# Altium schematic sheet CHIP.SchDoc: ICGTRRP2_CHIP
size A1; Author: M. Reza Pazhouhandeh; SheetNumber: 1; SheetTotal: 3; Time: Summer 2017
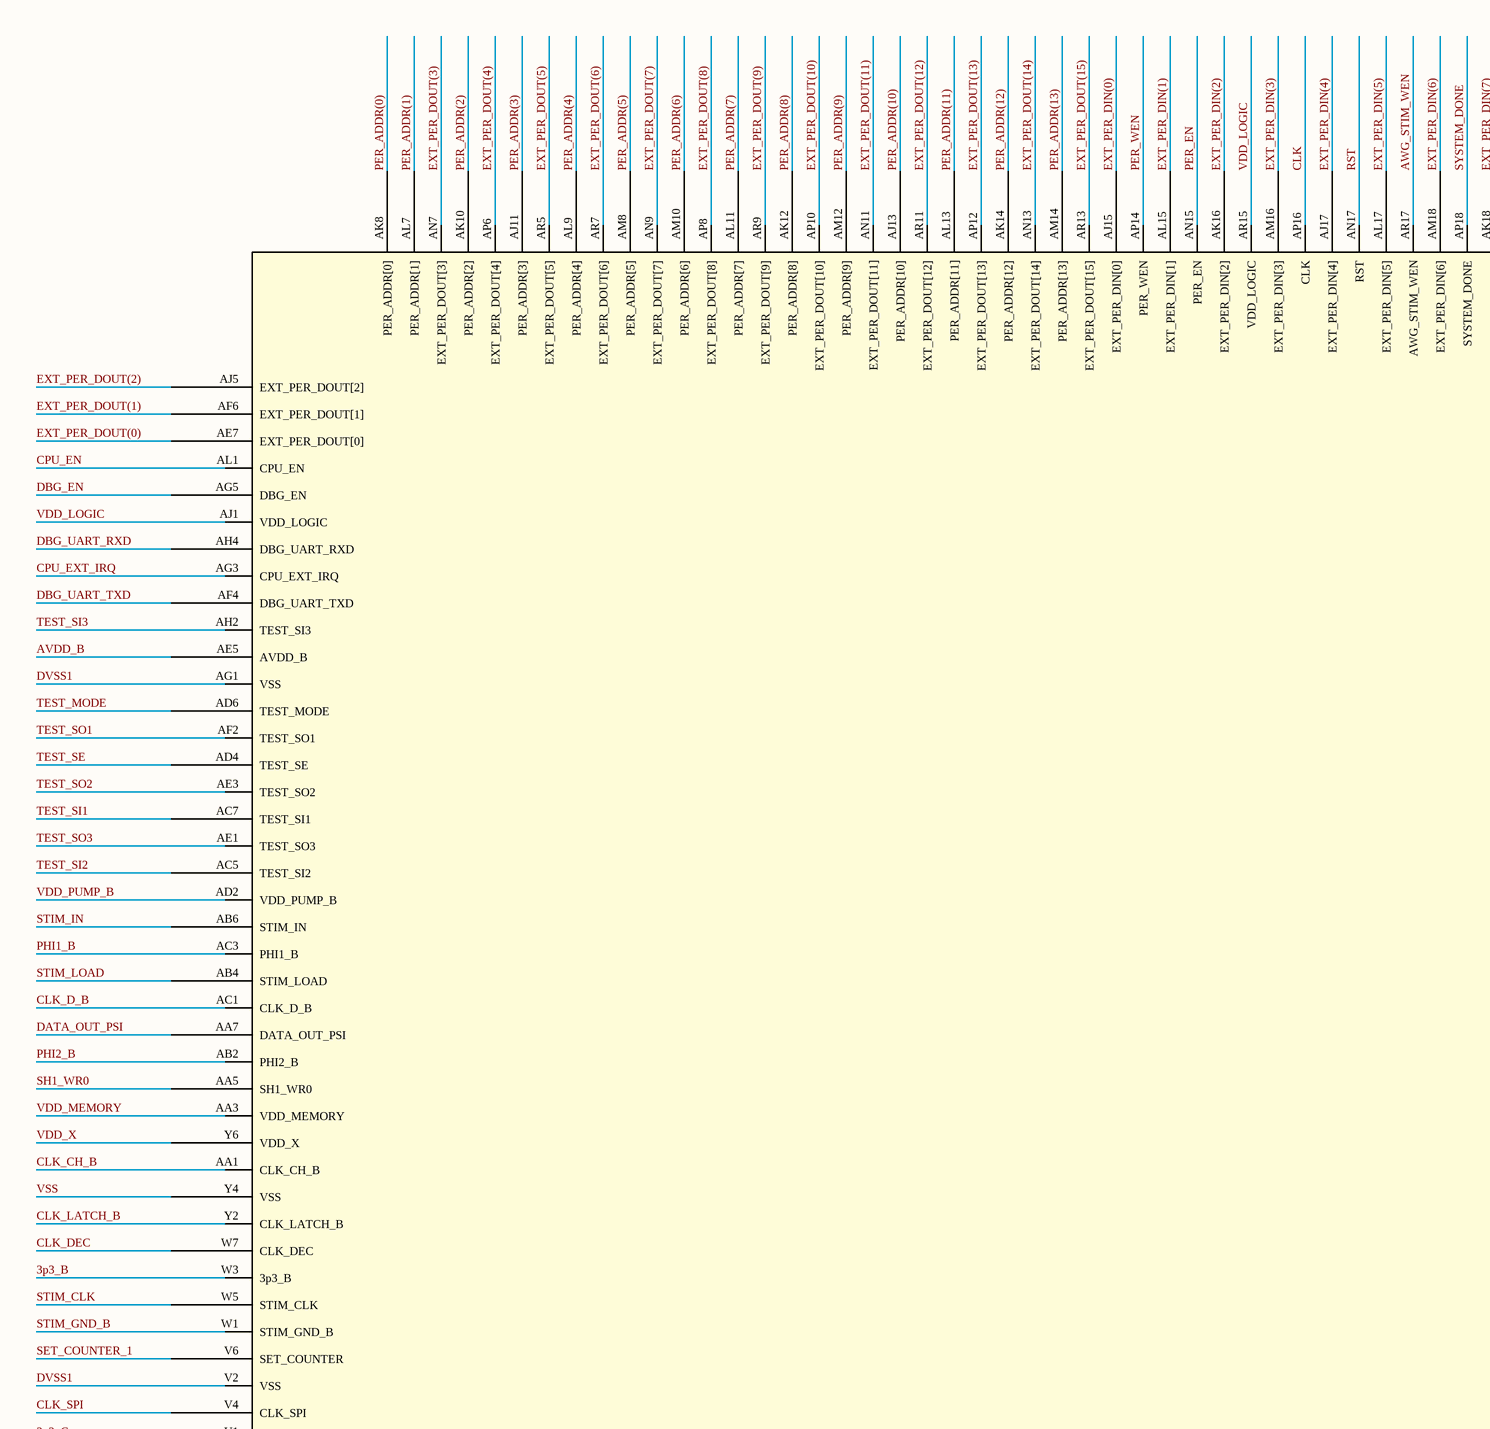
[diagram p0: CHIP.SchDoc, top left]
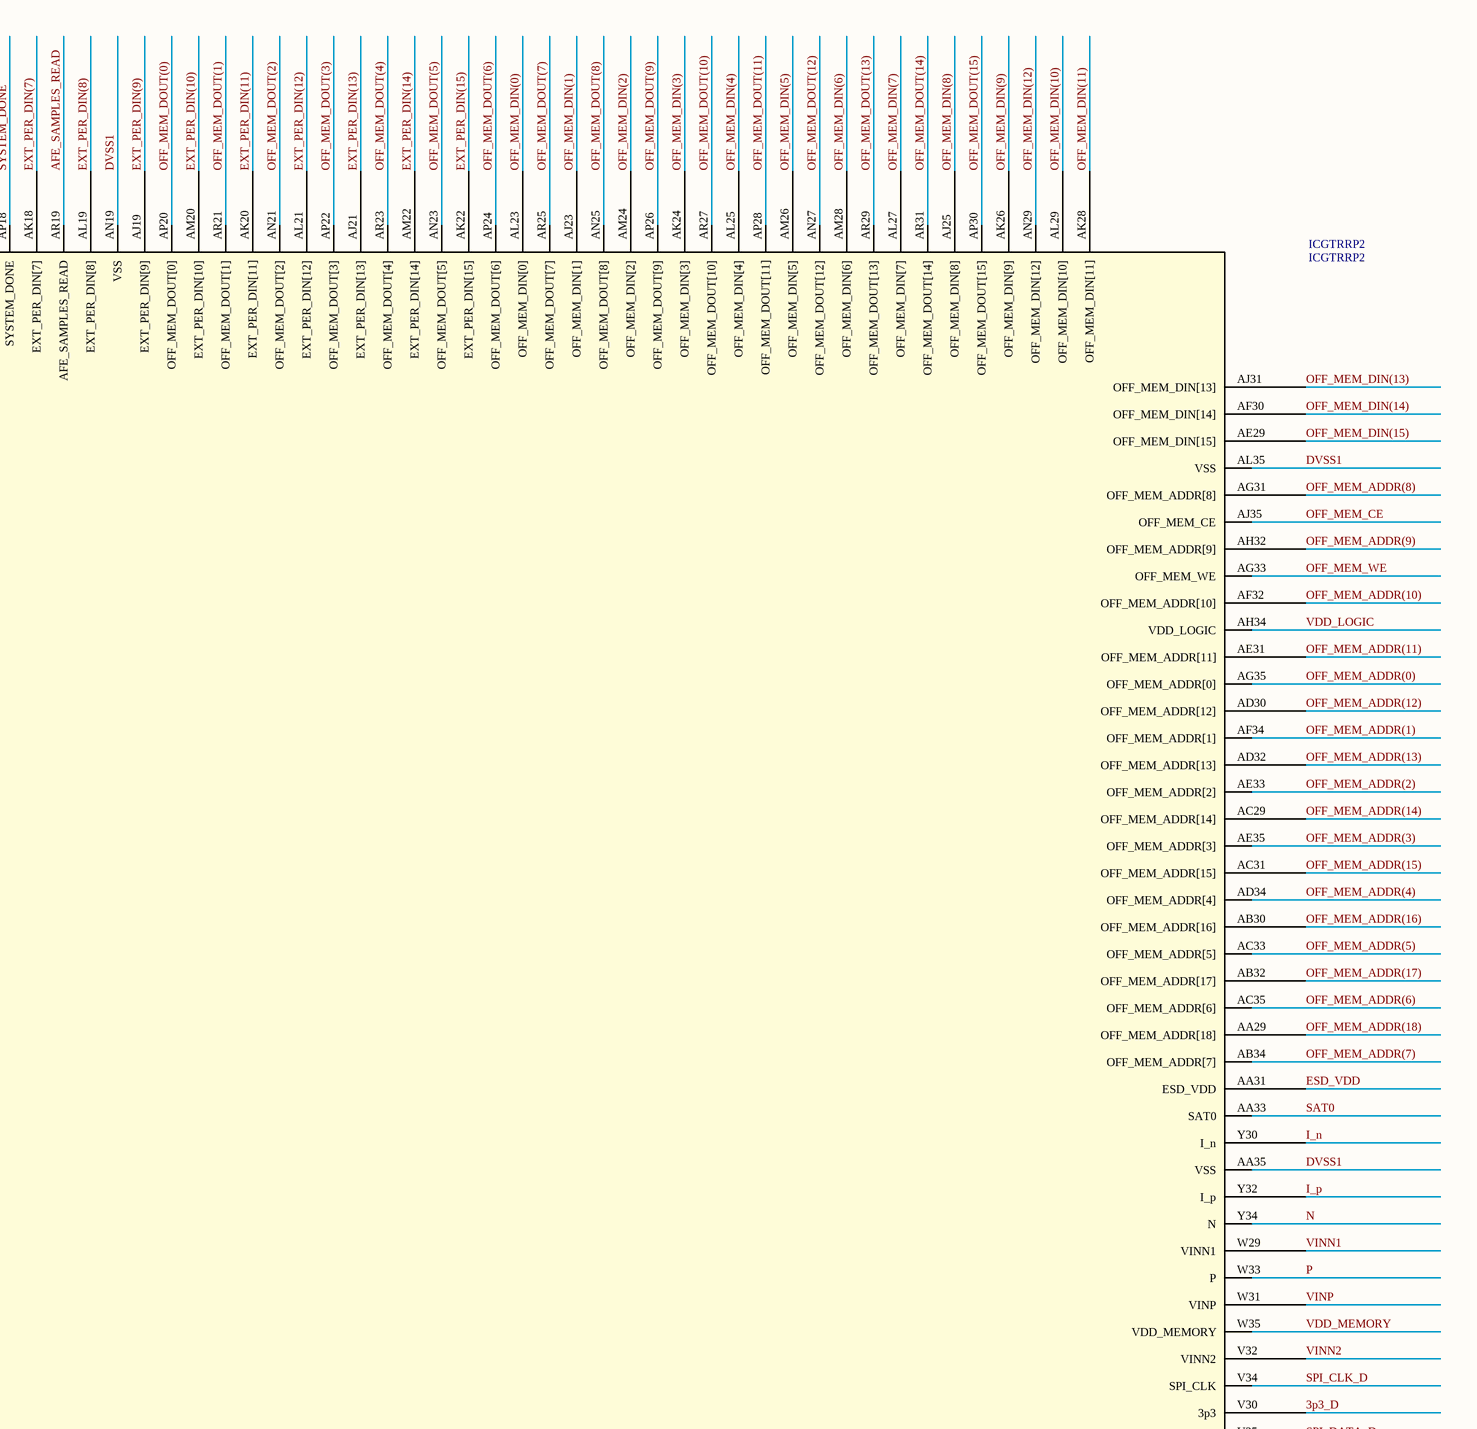
[diagram p1: CHIP.SchDoc, top right]
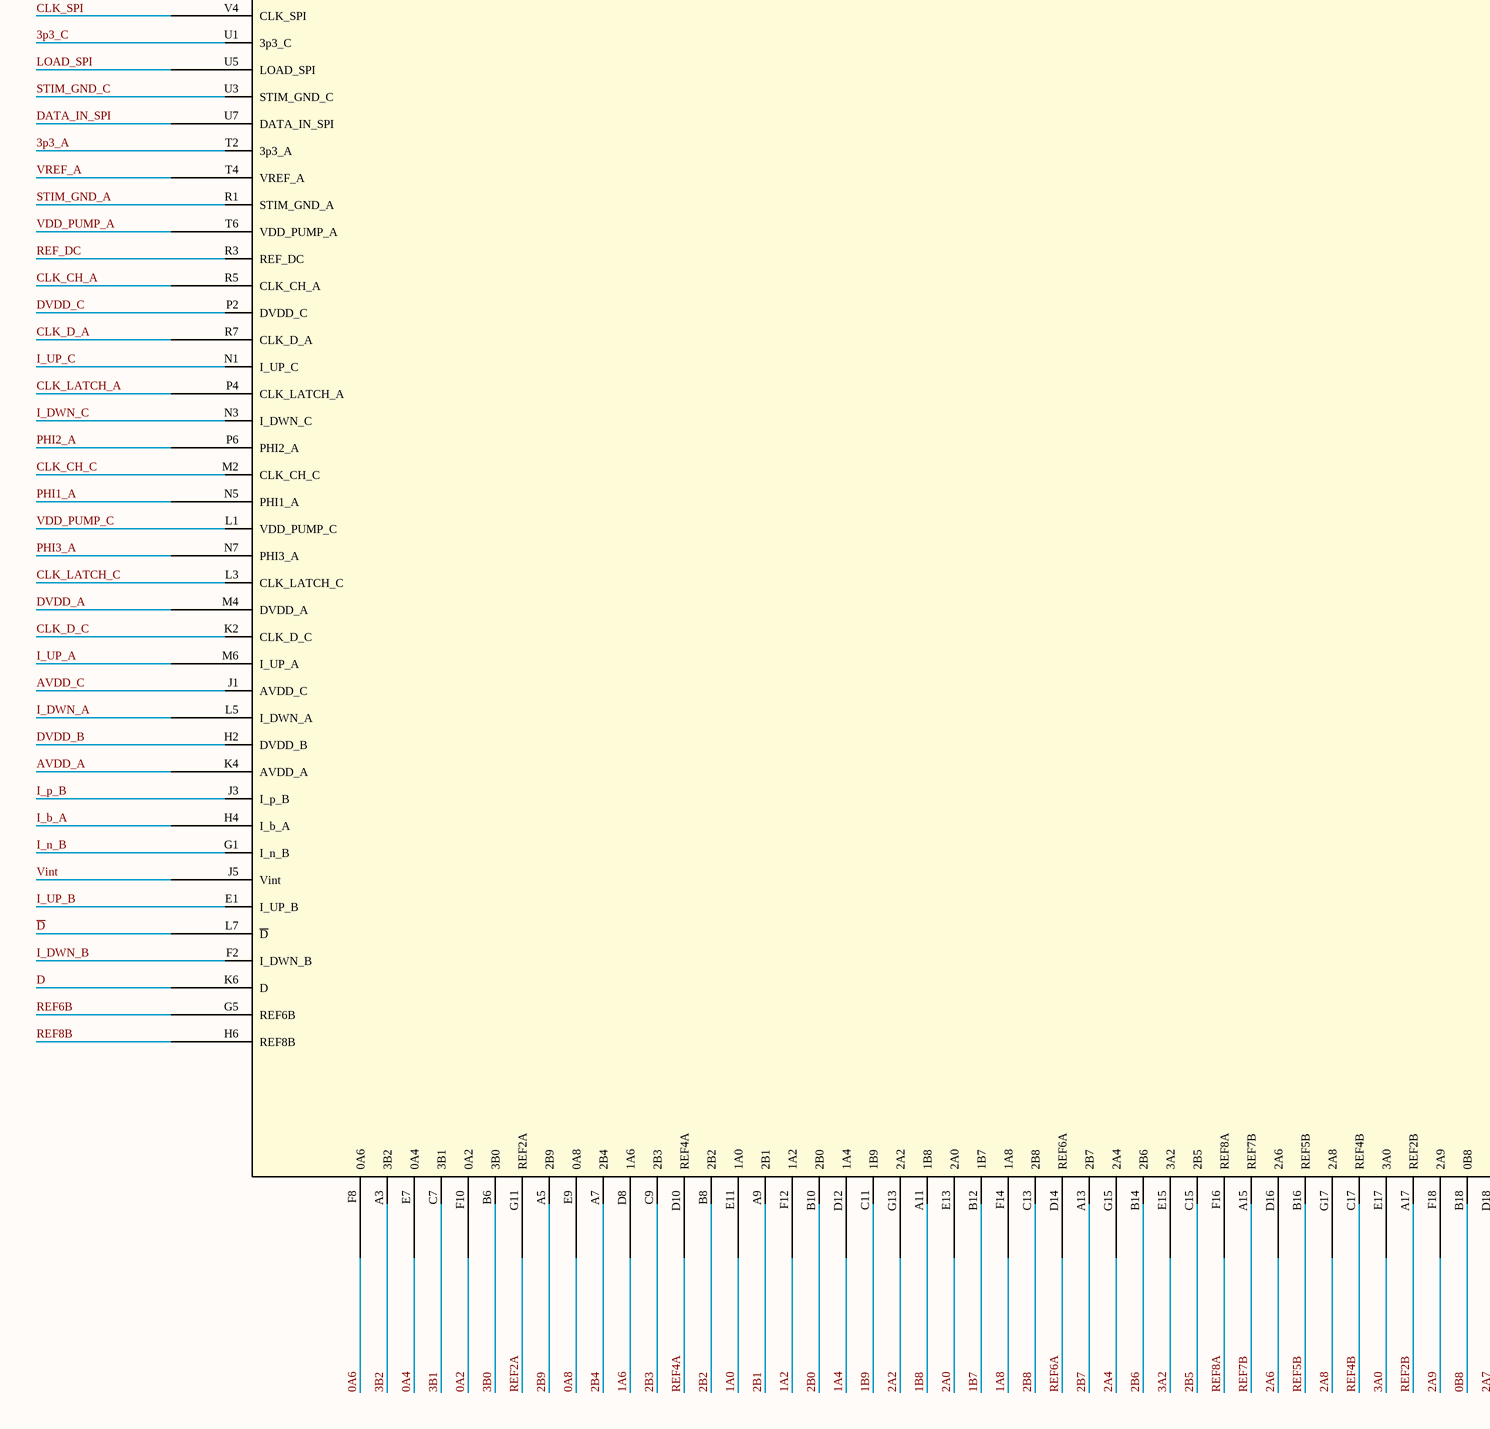
[diagram p2: CHIP.SchDoc, bottom left]
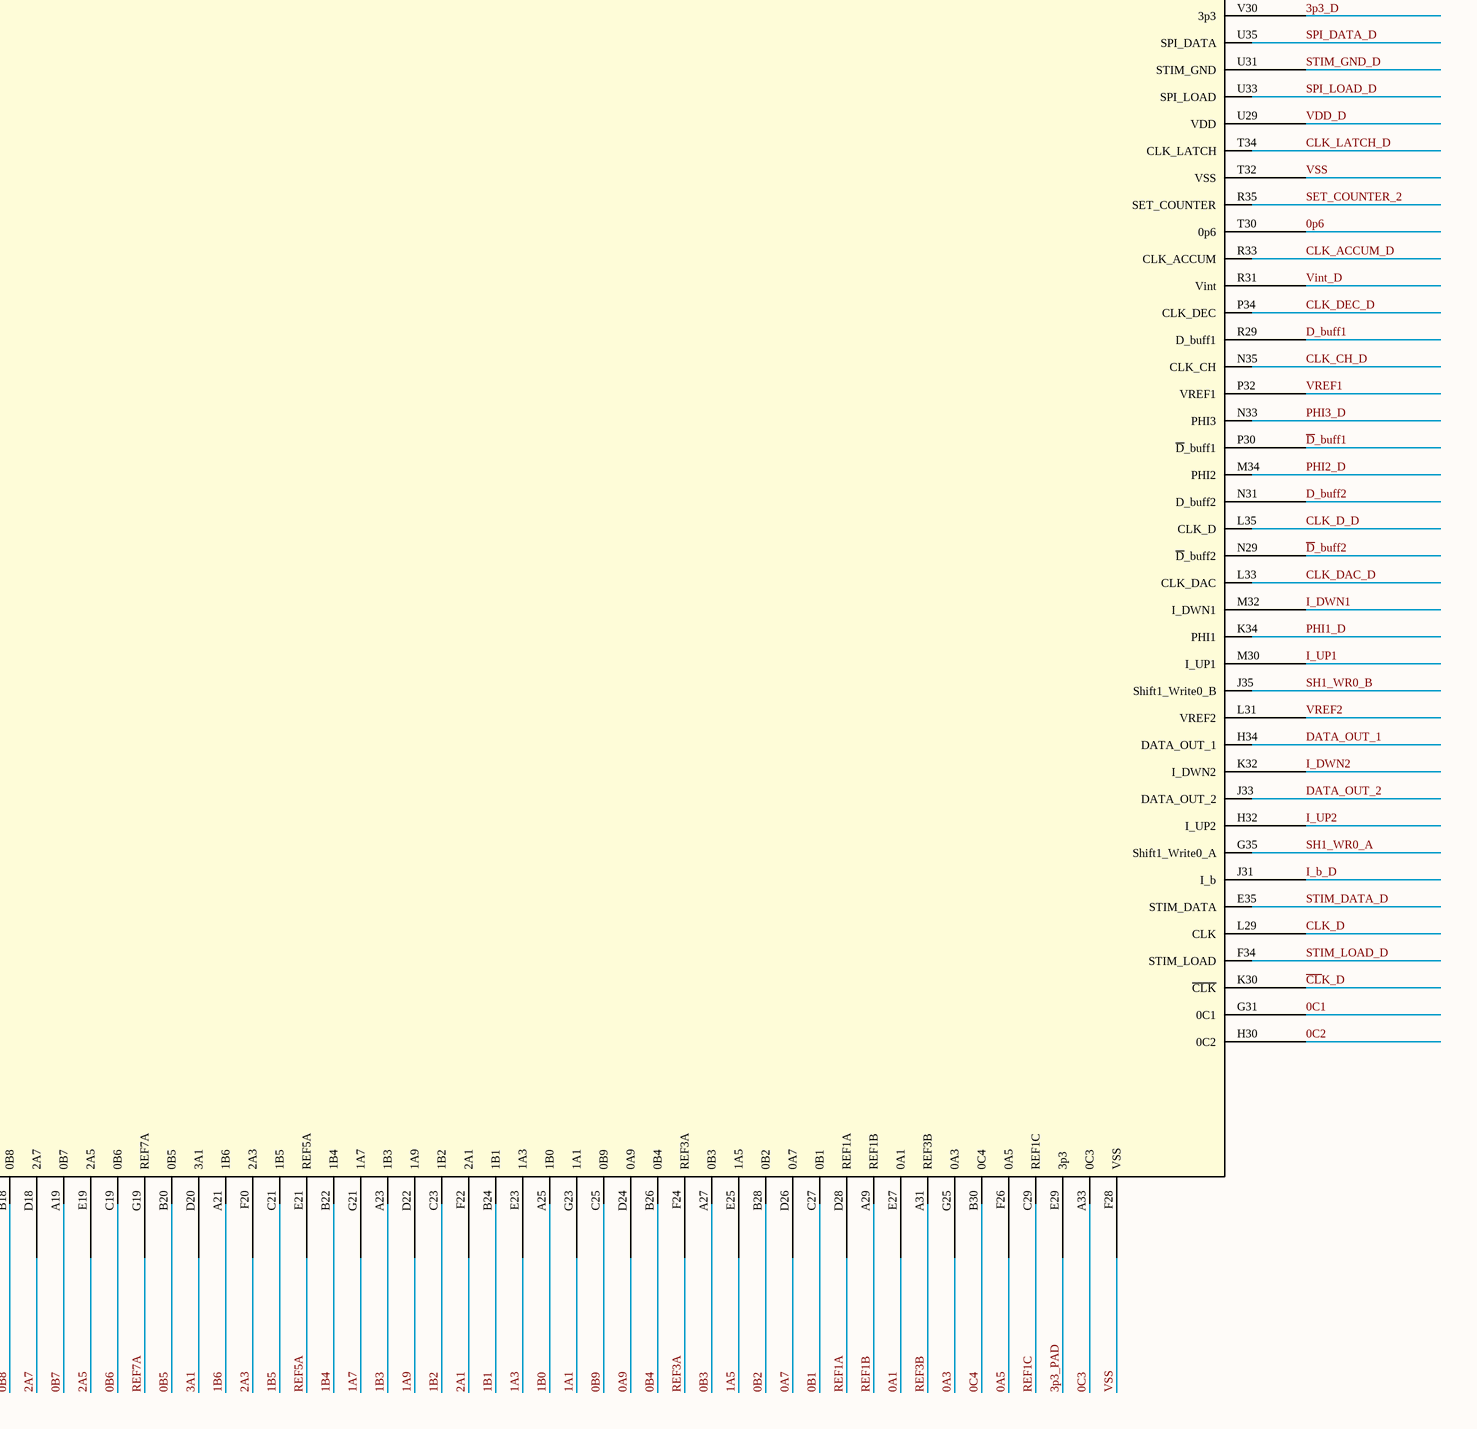
[diagram p3: CHIP.SchDoc, bottom right]

## Parts
ICGTRRP2  ICGTRRP2  [PGA391]

## Nets
0A1: ICGTRRP2.E27(0A1)
0A2: ICGTRRP2.F10(0A2)
0A3: ICGTRRP2.G25(0A3)
0A4: ICGTRRP2.E7(0A4)
0A5: ICGTRRP2.F26(0A5)
0A6: ICGTRRP2.F8(0A6)
0A7: ICGTRRP2.D26(0A7)
0A8: ICGTRRP2.E9(0A8)
0A9: ICGTRRP2.D24(0A9)
0B1: ICGTRRP2.C27(0B1)
0B2: ICGTRRP2.B28(0B2)
0B3: ICGTRRP2.A27(0B3)
0B4: ICGTRRP2.B26(0B4)
0B5: ICGTRRP2.B20(0B5)
0B6: ICGTRRP2.C19(0B6)
0B7: ICGTRRP2.A19(0B7)
0B8: ICGTRRP2.B18(0B8)
0B9: ICGTRRP2.C25(0B9)
0C1: ICGTRRP2.G31(0C1)
0C2: ICGTRRP2.H30(0C2)
0C3: ICGTRRP2.A33(0C3)
0C4: ICGTRRP2.B30(0C4)
0p6: ICGTRRP2.T30(0p6)
1A0: ICGTRRP2.E11(1A0)
1A1: ICGTRRP2.G23(1A1)
1A2: ICGTRRP2.F12(1A2)
1A3: ICGTRRP2.E23(1A3)
1A4: ICGTRRP2.D12(1A4)
1A5: ICGTRRP2.E25(1A5)
1A6: ICGTRRP2.D8(1A6)
1A7: ICGTRRP2.G21(1A7)
1A8: ICGTRRP2.F14(1A8)
1A9: ICGTRRP2.D22(1A9)
1B0: ICGTRRP2.A25(1B0)
1B1: ICGTRRP2.B24(1B1)
1B2: ICGTRRP2.C23(1B2)
1B3: ICGTRRP2.A23(1B3)
1B4: ICGTRRP2.B22(1B4)
1B5: ICGTRRP2.C21(1B5)
1B6: ICGTRRP2.A21(1B6)
1B7: ICGTRRP2.B12(1B7)
1B8: ICGTRRP2.A11(1B8)
1B9: ICGTRRP2.C11(1B9)
2A0: ICGTRRP2.E13(2A0)
2A1: ICGTRRP2.F22(2A1)
2A2: ICGTRRP2.G13(2A2)
2A3: ICGTRRP2.F20(2A3)
2A4: ICGTRRP2.G15(2A4)
2A5: ICGTRRP2.E19(2A5)
2A6: ICGTRRP2.D16(2A6)
2A7: ICGTRRP2.D18(2A7)
2A8: ICGTRRP2.G17(2A8)
2A9: ICGTRRP2.F18(2A9)
2B0: ICGTRRP2.B10(2B0)
2B1: ICGTRRP2.A9(2B1)
2B2: ICGTRRP2.B8(2B2)
2B3: ICGTRRP2.C9(2B3)
2B4: ICGTRRP2.A7(2B4)
2B5: ICGTRRP2.C15(2B5)
2B6: ICGTRRP2.B14(2B6)
2B7: ICGTRRP2.A13(2B7)
2B8: ICGTRRP2.C13(2B8)
2B9: ICGTRRP2.A5(2B9)
3A0: ICGTRRP2.E17(3A0)
3A1: ICGTRRP2.D20(3A1)
3A2: ICGTRRP2.E15(3A2)
3B0: ICGTRRP2.B6(3B0)
3B1: ICGTRRP2.C7(3B1)
3B2: ICGTRRP2.A3(3B2)
3p3_A: ICGTRRP2.T2(3p3_A)
3p3_B: ICGTRRP2.W3(3p3_B)
3p3_C: ICGTRRP2.U1(3p3_C)
3p3_D: ICGTRRP2.V30(3p3)
3p3_PAD: ICGTRRP2.E29(3p3)
AFE_SAMPLES_READ: ICGTRRP2.AR19(AFE_SAMPLES_READ)
AVDD_A: ICGTRRP2.K4(AVDD_A)
AVDD_B: ICGTRRP2.AE5(AVDD_B)
AVDD_C: ICGTRRP2.J1(AVDD_C)
AWG_STIM_WEN: ICGTRRP2.AR17(AWG_STIM_WEN)
~{CL}K_D: ICGTRRP2.K30(~{CLK})
CLK: ICGTRRP2.AP16(CLK)
CLK_ACCUM_D: ICGTRRP2.R33(CLK_ACCUM)
CLK_CH_A: ICGTRRP2.R5(CLK_CH_A)
CLK_CH_B: ICGTRRP2.AA1(CLK_CH_B)
CLK_CH_C: ICGTRRP2.M2(CLK_CH_C)
CLK_CH_D: ICGTRRP2.N35(CLK_CH)
CLK_D: ICGTRRP2.L29(CLK)
CLK_D_A: ICGTRRP2.R7(CLK_D_A)
CLK_D_B: ICGTRRP2.AC1(CLK_D_B)
CLK_D_C: ICGTRRP2.K2(CLK_D_C)
CLK_D_D: ICGTRRP2.L35(CLK_D)
CLK_DAC_D: ICGTRRP2.L33(CLK_DAC)
CLK_DEC: ICGTRRP2.W7(CLK_DEC)
CLK_DEC_D: ICGTRRP2.P34(CLK_DEC)
CLK_LATCH_A: ICGTRRP2.P4(CLK_LATCH_A)
CLK_LATCH_B: ICGTRRP2.Y2(CLK_LATCH_B)
CLK_LATCH_C: ICGTRRP2.L3(CLK_LATCH_C)
CLK_LATCH_D: ICGTRRP2.T34(CLK_LATCH)
CLK_SPI: ICGTRRP2.V4(CLK_SPI)
CPU_EN: ICGTRRP2.AL1(CPU_EN)
CPU_EXT_IRQ: ICGTRRP2.AG3(CPU_EXT_IRQ)
D: ICGTRRP2.K6(D)
~{D}: ICGTRRP2.L7(~{D})
~{D}_buff1: ICGTRRP2.P30(~{D}_buff1)
~{D}_buff2: ICGTRRP2.N29(~{D}_buff2)
D_buff1: ICGTRRP2.R29(D_buff1)
D_buff2: ICGTRRP2.N31(D_buff2)
DATA_IN_SPI: ICGTRRP2.U7(DATA_IN_SPI)
DATA_OUT_1: ICGTRRP2.H34(DATA_OUT_1)
DATA_OUT_2: ICGTRRP2.J33(DATA_OUT_2)
DATA_OUT_PSI: ICGTRRP2.AA7(DATA_OUT_PSI)
DBG_EN: ICGTRRP2.AG5(DBG_EN)
DBG_UART_RXD: ICGTRRP2.AH4(DBG_UART_RXD)
DBG_UART_TXD: ICGTRRP2.AF4(DBG_UART_TXD)
DVDD_A: ICGTRRP2.M4(DVDD_A)
DVDD_B: ICGTRRP2.H2(DVDD_B)
DVDD_C: ICGTRRP2.P2(DVDD_C)
DVSS1: ICGTRRP2.AA35(VSS) ICGTRRP2.AG1(VSS) ICGTRRP2.AL35(VSS) ICGTRRP2.AN19(VSS) ICGTRRP2.V2(VSS)
ESD_VDD: ICGTRRP2.AA31(ESD_VDD)
EXT_PER_DIN(0): ICGTRRP2.AJ15(EXT_PER_DIN[0])
EXT_PER_DIN(1): ICGTRRP2.AL15(EXT_PER_DIN[1])
EXT_PER_DIN(2): ICGTRRP2.AK16(EXT_PER_DIN[2])
EXT_PER_DIN(3): ICGTRRP2.AM16(EXT_PER_DIN[3])
EXT_PER_DIN(4): ICGTRRP2.AJ17(EXT_PER_DIN[4])
EXT_PER_DIN(5): ICGTRRP2.AL17(EXT_PER_DIN[5])
EXT_PER_DIN(6): ICGTRRP2.AM18(EXT_PER_DIN[6])
EXT_PER_DIN(7): ICGTRRP2.AK18(EXT_PER_DIN[7])
EXT_PER_DIN(8): ICGTRRP2.AL19(EXT_PER_DIN[8])
EXT_PER_DIN(9): ICGTRRP2.AJ19(EXT_PER_DIN[9])
EXT_PER_DIN(10): ICGTRRP2.AM20(EXT_PER_DIN[10])
EXT_PER_DIN(11): ICGTRRP2.AK20(EXT_PER_DIN[11])
EXT_PER_DIN(12): ICGTRRP2.AL21(EXT_PER_DIN[12])
EXT_PER_DIN(13): ICGTRRP2.AJ21(EXT_PER_DIN[13])
EXT_PER_DIN(14): ICGTRRP2.AM22(EXT_PER_DIN[14])
EXT_PER_DIN(15): ICGTRRP2.AK22(EXT_PER_DIN[15])
EXT_PER_DOUT(0): ICGTRRP2.AE7(EXT_PER_DOUT[0])
EXT_PER_DOUT(1): ICGTRRP2.AF6(EXT_PER_DOUT[1])
EXT_PER_DOUT(2): ICGTRRP2.AJ5(EXT_PER_DOUT[2])
EXT_PER_DOUT(3): ICGTRRP2.AN7(EXT_PER_DOUT[3])
EXT_PER_DOUT(4): ICGTRRP2.AP6(EXT_PER_DOUT[4])
EXT_PER_DOUT(5): ICGTRRP2.AR5(EXT_PER_DOUT[5])
EXT_PER_DOUT(6): ICGTRRP2.AR7(EXT_PER_DOUT[6])
EXT_PER_DOUT(7): ICGTRRP2.AN9(EXT_PER_DOUT[7])
EXT_PER_DOUT(8): ICGTRRP2.AP8(EXT_PER_DOUT[8])
EXT_PER_DOUT(9): ICGTRRP2.AR9(EXT_PER_DOUT[9])
EXT_PER_DOUT(10): ICGTRRP2.AP10(EXT_PER_DOUT[10])
EXT_PER_DOUT(11): ICGTRRP2.AN11(EXT_PER_DOUT[11])
EXT_PER_DOUT(12): ICGTRRP2.AR11(EXT_PER_DOUT[12])
EXT_PER_DOUT(13): ICGTRRP2.AP12(EXT_PER_DOUT[13])
EXT_PER_DOUT(14): ICGTRRP2.AN13(EXT_PER_DOUT[14])
EXT_PER_DOUT(15): ICGTRRP2.AR13(EXT_PER_DOUT[15])
I_b_A: ICGTRRP2.H4(I_b_A)
I_b_D: ICGTRRP2.J31(I_b)
I_DWN1: ICGTRRP2.M32(I_DWN1)
I_DWN2: ICGTRRP2.K32(I_DWN2)
I_DWN_A: ICGTRRP2.L5(I_DWN_A)
I_DWN_B: ICGTRRP2.F2(I_DWN_B)
I_DWN_C: ICGTRRP2.N3(I_DWN_C)
I_n: ICGTRRP2.Y30(I_n)
I_n_B: ICGTRRP2.G1(I_n_B)
I_p: ICGTRRP2.Y32(I_p)
I_p_B: ICGTRRP2.J3(I_p_B)
I_UP1: ICGTRRP2.M30(I_UP1)
I_UP2: ICGTRRP2.H32(I_UP2)
I_UP_A: ICGTRRP2.M6(I_UP_A)
I_UP_B: ICGTRRP2.E1(I_UP_B)
I_UP_C: ICGTRRP2.N1(I_UP_C)
LOAD_SPI: ICGTRRP2.U5(LOAD_SPI)
N: ICGTRRP2.Y34(N)
OFF_MEM_ADDR(0): ICGTRRP2.AG35(OFF_MEM_ADDR[0])
OFF_MEM_ADDR(1): ICGTRRP2.AF34(OFF_MEM_ADDR[1])
OFF_MEM_ADDR(2): ICGTRRP2.AE33(OFF_MEM_ADDR[2])
OFF_MEM_ADDR(3): ICGTRRP2.AE35(OFF_MEM_ADDR[3])
OFF_MEM_ADDR(4): ICGTRRP2.AD34(OFF_MEM_ADDR[4])
OFF_MEM_ADDR(5): ICGTRRP2.AC33(OFF_MEM_ADDR[5])
OFF_MEM_ADDR(6): ICGTRRP2.AC35(OFF_MEM_ADDR[6])
OFF_MEM_ADDR(7): ICGTRRP2.AB34(OFF_MEM_ADDR[7])
OFF_MEM_ADDR(8): ICGTRRP2.AG31(OFF_MEM_ADDR[8])
OFF_MEM_ADDR(9): ICGTRRP2.AH32(OFF_MEM_ADDR[9])
OFF_MEM_ADDR(10): ICGTRRP2.AF32(OFF_MEM_ADDR[10])
OFF_MEM_ADDR(11): ICGTRRP2.AE31(OFF_MEM_ADDR[11])
OFF_MEM_ADDR(12): ICGTRRP2.AD30(OFF_MEM_ADDR[12])
OFF_MEM_ADDR(13): ICGTRRP2.AD32(OFF_MEM_ADDR[13])
OFF_MEM_ADDR(14): ICGTRRP2.AC29(OFF_MEM_ADDR[14])
OFF_MEM_ADDR(15): ICGTRRP2.AC31(OFF_MEM_ADDR[15])
OFF_MEM_ADDR(16): ICGTRRP2.AB30(OFF_MEM_ADDR[16])
OFF_MEM_ADDR(17): ICGTRRP2.AB32(OFF_MEM_ADDR[17])
OFF_MEM_ADDR(18): ICGTRRP2.AA29(OFF_MEM_ADDR[18])
OFF_MEM_CE: ICGTRRP2.AJ35(OFF_MEM_CE)
OFF_MEM_DIN(0): ICGTRRP2.AL23(OFF_MEM_DIN[0])
OFF_MEM_DIN(1): ICGTRRP2.AJ23(OFF_MEM_DIN[1])
OFF_MEM_DIN(2): ICGTRRP2.AM24(OFF_MEM_DIN[2])
OFF_MEM_DIN(3): ICGTRRP2.AK24(OFF_MEM_DIN[3])
OFF_MEM_DIN(4): ICGTRRP2.AL25(OFF_MEM_DIN[4])
OFF_MEM_DIN(5): ICGTRRP2.AM26(OFF_MEM_DIN[5])
OFF_MEM_DIN(6): ICGTRRP2.AM28(OFF_MEM_DIN[6])
OFF_MEM_DIN(7): ICGTRRP2.AL27(OFF_MEM_DIN[7])
OFF_MEM_DIN(8): ICGTRRP2.AJ25(OFF_MEM_DIN[8])
OFF_MEM_DIN(9): ICGTRRP2.AK26(OFF_MEM_DIN[9])
OFF_MEM_DIN(10): ICGTRRP2.AL29(OFF_MEM_DIN[10])
OFF_MEM_DIN(11): ICGTRRP2.AK28(OFF_MEM_DIN[11])
OFF_MEM_DIN(12): ICGTRRP2.AN29(OFF_MEM_DIN[12])
OFF_MEM_DIN(13): ICGTRRP2.AJ31(OFF_MEM_DIN[13])
OFF_MEM_DIN(14): ICGTRRP2.AF30(OFF_MEM_DIN[14])
OFF_MEM_DIN(15): ICGTRRP2.AE29(OFF_MEM_DIN[15])
OFF_MEM_DOUT(0): ICGTRRP2.AP20(OFF_MEM_DOUT[0])
OFF_MEM_DOUT(1): ICGTRRP2.AR21(OFF_MEM_DOUT[1])
OFF_MEM_DOUT(2): ICGTRRP2.AN21(OFF_MEM_DOUT[2])
OFF_MEM_DOUT(3): ICGTRRP2.AP22(OFF_MEM_DOUT[3])
OFF_MEM_DOUT(4): ICGTRRP2.AR23(OFF_MEM_DOUT[4])
OFF_MEM_DOUT(5): ICGTRRP2.AN23(OFF_MEM_DOUT[5])
OFF_MEM_DOUT(6): ICGTRRP2.AP24(OFF_MEM_DOUT[6])
OFF_MEM_DOUT(7): ICGTRRP2.AR25(OFF_MEM_DOUT[7])
OFF_MEM_DOUT(8): ICGTRRP2.AN25(OFF_MEM_DOUT[8])
OFF_MEM_DOUT(9): ICGTRRP2.AP26(OFF_MEM_DOUT[9])
OFF_MEM_DOUT(10): ICGTRRP2.AR27(OFF_MEM_DOUT[10])
OFF_MEM_DOUT(11): ICGTRRP2.AP28(OFF_MEM_DOUT[11])
OFF_MEM_DOUT(12): ICGTRRP2.AN27(OFF_MEM_DOUT[12])
OFF_MEM_DOUT(13): ICGTRRP2.AR29(OFF_MEM_DOUT[13])
OFF_MEM_DOUT(14): ICGTRRP2.AR31(OFF_MEM_DOUT[14])
OFF_MEM_DOUT(15): ICGTRRP2.AP30(OFF_MEM_DOUT[15])
OFF_MEM_WE: ICGTRRP2.AG33(OFF_MEM_WE)
P: ICGTRRP2.W33(P)
PER_ADDR(0): ICGTRRP2.AK8(PER_ADDR[0])
PER_ADDR(1): ICGTRRP2.AL7(PER_ADDR[1])
PER_ADDR(2): ICGTRRP2.AK10(PER_ADDR[2])
PER_ADDR(3): ICGTRRP2.AJ11(PER_ADDR[3])
PER_ADDR(4): ICGTRRP2.AL9(PER_ADDR[4])
PER_ADDR(5): ICGTRRP2.AM8(PER_ADDR[5])
PER_ADDR(6): ICGTRRP2.AM10(PER_ADDR[6])
PER_ADDR(7): ICGTRRP2.AL11(PER_ADDR[7])
PER_ADDR(8): ICGTRRP2.AK12(PER_ADDR[8])
PER_ADDR(9): ICGTRRP2.AM12(PER_ADDR[9])
PER_ADDR(10): ICGTRRP2.AJ13(PER_ADDR[10])
PER_ADDR(11): ICGTRRP2.AL13(PER_ADDR[11])
PER_ADDR(12): ICGTRRP2.AK14(PER_ADDR[12])
PER_ADDR(13): ICGTRRP2.AM14(PER_ADDR[13])
PER_EN: ICGTRRP2.AN15(PER_EN)
PER_WEN: ICGTRRP2.AP14(PER_WEN)
PHI1_A: ICGTRRP2.N5(PHI1_A)
PHI1_B: ICGTRRP2.AC3(PHI1_B)
PHI1_D: ICGTRRP2.K34(PHI1)
PHI2_A: ICGTRRP2.P6(PHI2_A)
PHI2_B: ICGTRRP2.AB2(PHI2_B)
PHI2_D: ICGTRRP2.M34(PHI2)
PHI3_A: ICGTRRP2.N7(PHI3_A)
PHI3_D: ICGTRRP2.N33(PHI3)
REF1A: ICGTRRP2.D28(REF1A)
REF1B: ICGTRRP2.A29(REF1B)
REF1C: ICGTRRP2.C29(REF1C)
REF2A: ICGTRRP2.G11(REF2A)
REF2B: ICGTRRP2.A17(REF2B)
REF3A: ICGTRRP2.F24(REF3A)
REF3B: ICGTRRP2.A31(REF3B)
REF4A: ICGTRRP2.D10(REF4A)
REF4B: ICGTRRP2.C17(REF4B)
REF5A: ICGTRRP2.E21(REF5A)
REF5B: ICGTRRP2.B16(REF5B)
REF6A: ICGTRRP2.D14(REF6A)
REF6B: ICGTRRP2.G5(REF6B)
REF7A: ICGTRRP2.G19(REF7A)
REF7B: ICGTRRP2.A15(REF7B)
REF8A: ICGTRRP2.F16(REF8A)
REF8B: ICGTRRP2.H6(REF8B)
REF_DC: ICGTRRP2.R3(REF_DC)
RST: ICGTRRP2.AN17(RST)
SAT0: ICGTRRP2.AA33(SAT0)
SET_COUNTER_1: ICGTRRP2.V6(SET_COUNTER)
SET_COUNTER_2: ICGTRRP2.R35(SET_COUNTER)
SH1_WR0: ICGTRRP2.AA5(SH1_WR0)
SH1_WR0_A: ICGTRRP2.G35(Shift1_Write0_A)
SH1_WR0_B: ICGTRRP2.J35(Shift1_Write0_B)
SPI_CLK_D: ICGTRRP2.V34(SPI_CLK)
SPI_DATA_D: ICGTRRP2.U35(SPI_DATA)
SPI_LOAD_D: ICGTRRP2.U33(SPI_LOAD)
STIM_CLK: ICGTRRP2.W5(STIM_CLK)
STIM_DATA_D: ICGTRRP2.E35(STIM_DATA)
STIM_GND_A: ICGTRRP2.R1(STIM_GND_A)
STIM_GND_B: ICGTRRP2.W1(STIM_GND_B)
STIM_GND_C: ICGTRRP2.U3(STIM_GND_C)
STIM_GND_D: ICGTRRP2.U31(STIM_GND)
STIM_IN: ICGTRRP2.AB6(STIM_IN)
STIM_LOAD: ICGTRRP2.AB4(STIM_LOAD)
STIM_LOAD_D: ICGTRRP2.F34(STIM_LOAD)
SYSTEM_DONE: ICGTRRP2.AP18(SYSTEM_DONE)
TEST_MODE: ICGTRRP2.AD6(TEST_MODE)
TEST_SE: ICGTRRP2.AD4(TEST_SE)
TEST_SI1: ICGTRRP2.AC7(TEST_SI1)
TEST_SI2: ICGTRRP2.AC5(TEST_SI2)
TEST_SI3: ICGTRRP2.AH2(TEST_SI3)
TEST_SO1: ICGTRRP2.AF2(TEST_SO1)
TEST_SO2: ICGTRRP2.AE3(TEST_SO2)
TEST_SO3: ICGTRRP2.AE1(TEST_SO3)
VDD_D: ICGTRRP2.U29(VDD)
VDD_LOGIC: ICGTRRP2.AH34(VDD_LOGIC) ICGTRRP2.AJ1(VDD_LOGIC) ICGTRRP2.AR15(VDD_LOGIC)
VDD_MEMORY: ICGTRRP2.AA3(VDD_MEMORY) ICGTRRP2.W35(VDD_MEMORY)
VDD_PUMP_A: ICGTRRP2.T6(VDD_PUMP_A)
VDD_PUMP_B: ICGTRRP2.AD2(VDD_PUMP_B)
VDD_PUMP_C: ICGTRRP2.L1(VDD_PUMP_C)
VDD_X: ICGTRRP2.Y6(VDD_X)
VINN1: ICGTRRP2.W29(VINN1)
VINN2: ICGTRRP2.V32(VINN2)
VINP: ICGTRRP2.W31(VINP)
Vint: ICGTRRP2.J5(Vint)
Vint_D: ICGTRRP2.R31(Vint)
VREF1: ICGTRRP2.P32(VREF1)
VREF2: ICGTRRP2.L31(VREF2)
VREF_A: ICGTRRP2.T4(VREF_A)
VSS: ICGTRRP2.F28(VSS) ICGTRRP2.T32(VSS) ICGTRRP2.Y4(VSS)

## Library data of the parts
ICGTRRP2 = PGA391